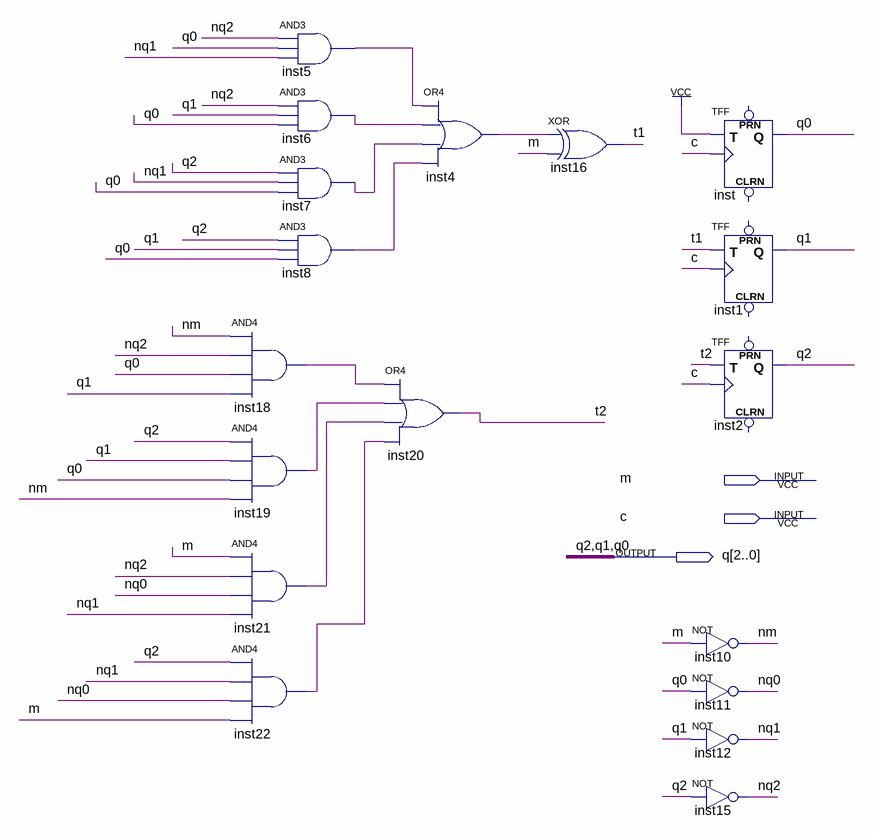
[diagram p0: schematic sheet]
// Quartus schematic s22.bdf as structural Verilog: 18 symbols, 3 pins
module s22 (
  input  m,
  input  c,
  output [2:0] q
);

  wire inst4_out, inst5_out, inst6_out, inst7_out, inst8_out, inst18_out, inst19_out, inst21_out, inst22_out,
       nm, nq0, nq1, nq2, t1, t2;

  and inst5 (inst5_out, nq2, q[0], nq1);
  and inst6 (inst6_out, nq2, q[1], q[0]);
  and inst7 (inst7_out, q[2], nq1, q[0]);
  and inst8 (inst8_out, q[2], q[1], q[0]);
  and inst18 (inst18_out, nm, nq2, q[0], q[1]);
  and inst19 (inst19_out, q[2], q[1], q[0], nm);
  and inst21 (inst21_out, m, nq2, nq0, nq1);
  and inst22 (inst22_out, q[2], nq1, nq0, m);
  or inst4 (inst4_out, inst5_out, inst6_out, inst7_out, inst8_out);
  or inst20 (t2, inst18_out, inst19_out, inst21_out, inst22_out);
  xor inst16 (t1, inst4_out, m);
  TFF inst (.T(1'b1), .CLK(c), .Q(q[0]));  // open: PRN, CLRN
  TFF inst1 (.T(t1), .CLK(c), .Q(q[1]));  // open: PRN, CLRN
  TFF inst2 (.T(t2), .CLK(c), .Q(q[2]));  // open: PRN, CLRN
  not inst10 (nm, m);
  not inst11 (nq0, q[0]);
  not inst12 (nq1, q[1]);
  not inst15 (nq2, q[2]);
endmodule
